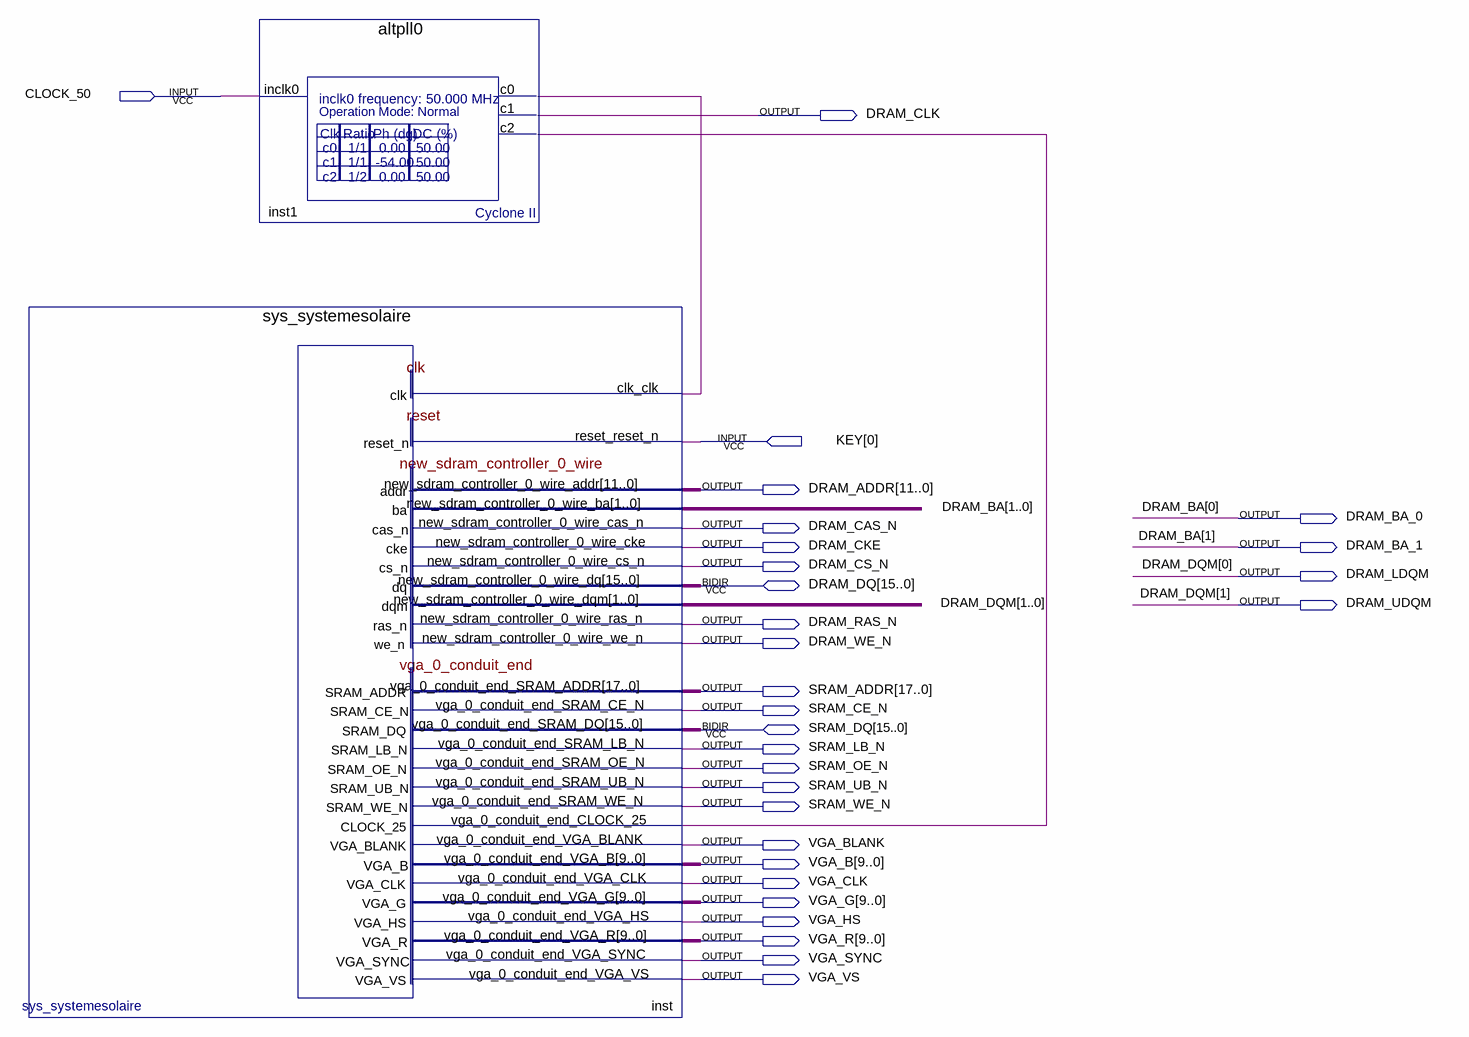
[diagram p0: schematic sheet]
// Quartus schematic systemesolaire.bdf as structural Verilog: 2 symbols, 29 pins
module systemesolaire (
  input  CLOCK_50,
  input  [0:0] KEY,
  inout  [15:0] DRAM_DQ,
  inout  [15:0] SRAM_DQ,
  output DRAM_CLK,
  output [11:0] DRAM_ADDR,
  output DRAM_BA_0,
  output DRAM_CAS_N,
  output DRAM_CKE,
  output DRAM_BA_1,
  output DRAM_CS_N,
  output DRAM_LDQM,
  output DRAM_UDQM,
  output DRAM_RAS_N,
  output DRAM_WE_N,
  output [17:0] SRAM_ADDR,
  output SRAM_CE_N,
  output SRAM_LB_N,
  output SRAM_OE_N,
  output SRAM_UB_N,
  output SRAM_WE_N,
  output VGA_BLANK,
  output [9:0] VGA_B,
  output VGA_CLK,
  output [9:0] VGA_G,
  output VGA_HS,
  output [9:0] VGA_R,
  output VGA_SYNC,
  output VGA_VS
);

  wire inst1_c0, inst1_c2;

  sys_systemesolaire inst (
    .clk_clk(inst1_c0), .reset_reset_n(KEY[0]), .vga_0_conduit_end_CLOCK_25(inst1_c2),
    .new_sdram_controller_0_wire_addr(DRAM_ADDR), .new_sdram_controller_0_wire_ba({DRAM_BA_1, DRAM_BA_0}),
    .new_sdram_controller_0_wire_cas_n(DRAM_CAS_N), .new_sdram_controller_0_wire_cke(DRAM_CKE),
    .new_sdram_controller_0_wire_cs_n(DRAM_CS_N), .new_sdram_controller_0_wire_dqm({DRAM_UDQM, DRAM_LDQM}),
    .new_sdram_controller_0_wire_ras_n(DRAM_RAS_N), .new_sdram_controller_0_wire_we_n(DRAM_WE_N),
    .vga_0_conduit_end_SRAM_ADDR(SRAM_ADDR), .vga_0_conduit_end_SRAM_CE_N(SRAM_CE_N),
    .vga_0_conduit_end_SRAM_LB_N(SRAM_LB_N), .vga_0_conduit_end_SRAM_OE_N(SRAM_OE_N),
    .vga_0_conduit_end_SRAM_UB_N(SRAM_UB_N), .vga_0_conduit_end_SRAM_WE_N(SRAM_WE_N),
    .vga_0_conduit_end_VGA_BLANK(VGA_BLANK), .vga_0_conduit_end_VGA_B(VGA_B),
    .vga_0_conduit_end_VGA_CLK(VGA_CLK), .vga_0_conduit_end_VGA_G(VGA_G), .vga_0_conduit_end_VGA_HS(VGA_HS),
    .vga_0_conduit_end_VGA_R(VGA_R), .vga_0_conduit_end_VGA_SYNC(VGA_SYNC),
    .vga_0_conduit_end_VGA_VS(VGA_VS), .new_sdram_controller_0_wire_dq(DRAM_DQ),
    .vga_0_conduit_end_SRAM_DQ(SRAM_DQ));
  altpll0 inst1 (.inclk0(CLOCK_50), .c0(inst1_c0), .c1(DRAM_CLK), .c2(inst1_c2));

  // Other names for the same wires on the sheet: DRAM_BA[1:0] = {DRAM_BA_1, DRAM_BA_0};
  //   DRAM_DQM[1:0] = {DRAM_UDQM, DRAM_LDQM}
endmodule
